# Altium schematic sheet MAIN.SchDoc
size Legal; Author: FF7 HD Remastered; SheetNumber: 1; SheetTotal: 7
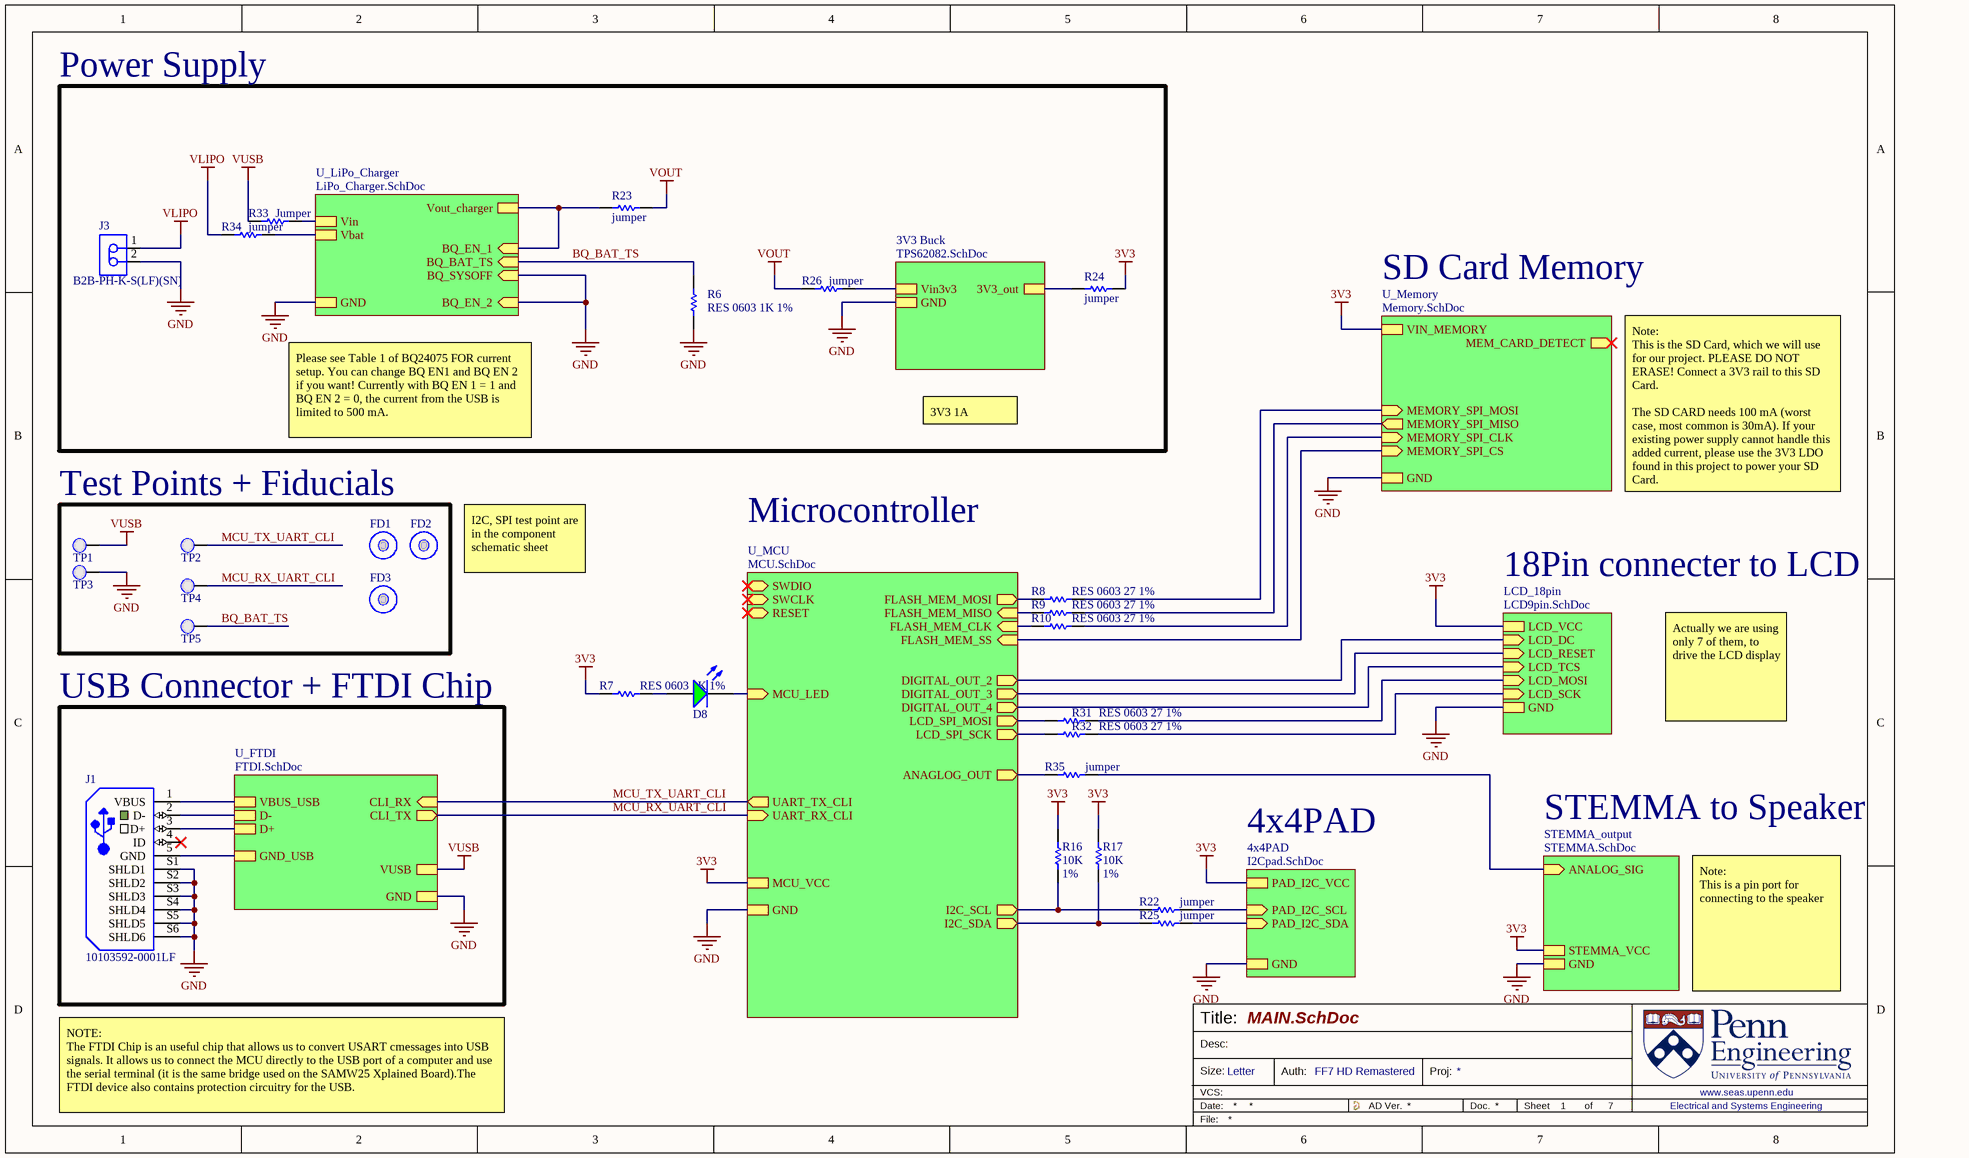
[diagram p0: MAIN.SchDoc]

## Parts
D8  LSM0805452V  [LED_0805]  (value not drawn)
FD1  Fiducial 40x100mm  [Fiducial 40x100mm-Footprint-1]  (value not drawn)
FD2  Fiducial 40x100mm  [Fiducial 40x100mm-Footprint-1]  (value not drawn)
FD3  Fiducial 40x100mm  [Fiducial 40x100mm-Footprint-1]  (value not drawn)
J1  10103592-0001LF  [10103592-0001LF-Footprint-1]
J3  B2B-PH-K-S(LF)(SN)  [JST-B2B-PH-K-S_V]
R6  RES 0603 1K 1%  [0603_RES]
R7  RES 0603 1K 1%  [0603_RES]
R8  RES 0603 27 1%  [0603_RES]
R9  RES 0603 27 1%  [0603_RES]
R10  RES 0603 27 1%  [0603_RES]
R16  value 10K  Tolerance: 1%  [0402_RES]  (hidden comment: RES 0402 10K 1%)
R17  value 10K  Tolerance: 1%  [0402_RES]  (hidden comment: RES 0402 10K 1%)
R22  jumper  [0805_RES]  (no BOM)
R23  jumper  [0805_RES]  (no BOM)
R24  jumper  [0805_RES]  (no BOM)
R25  jumper  [0805_RES]  (no BOM)
R26  jumper  [0805_RES]  (no BOM)
R31  RES 0603 27 1%  [0603_RES]
R32  RES 0603 27 1%  [0603_RES]
R33  Jumper  [0805_RES]  (no BOM)
R34  jumper  [0805_RES]  (no BOM)
R35  jumper  [0805_RES]  (no BOM)
TP1  Test Point 0.1"  [Test Point 0.1"-Footprint-1]  (value not drawn)  (no BOM)
TP2  Test Point 0.1"  [Test Point 0.1"-Footprint-1]  (value not drawn)  (no BOM)
TP3  Test Point 0.1"  [Test Point 0.1"-Footprint-1]  (value not drawn)  (no BOM)
TP4  Test Point 0.1"  [Test Point 0.1"-Footprint-1]  (value not drawn)  (no BOM)
TP5  Test Point 0.1"  [Test Point 0.1"-Footprint-1]  (value not drawn)  (no BOM)

## Blocks framed on the sheet
Power Supply: J3 R6 R23 R24 R26 R33 R34
Test Points + Fiducials: FD1-FD3 TP1-TP5
USB Connector + FTDI Chip: J1

## Sub-sheets
3V3 Buck = TPS62082.SchDoc: Vin3v3, GND, 3V3_out
4x4PAD = I2Cpad.SchDoc: PAD_I2C_SCL (in), PAD_I2C_SDA (in), PAD_I2C_VCC, GND
LCD_18pin = LCD9pin.SchDoc: LCD_VCC, LCD_SCK (in), LCD_MOSI (in), LCD_DC (in), LCD_RESET (in), LCD_TCS (in), GND
STEMMA_output = STEMMA.SchDoc: ANALOG_SIG (in), STEMMA_VCC, GND
U_FTDI = FTDI.SchDoc: CLI_RX (in), CLI_TX (out), VUSB, GND, VBUS_USB, D-, D+, GND_USB
U_LiPo_Charger = LiPo_Charger.SchDoc: BQ_EN_2 (in), BQ_SYSOFF (in), BQ_EN_1 (in), BQ_BAT_TS (in), Vin, GND, Vbat, Vout_charger
U_MCU = MCU.SchDoc: SWDIO (bidir), SWCLK (in), UART_TX_CLI (out), UART_RX_CLI (in), FLASH_MEM_SS (in), FLASH_MEM_CLK (in), FLASH_MEM_MISO (in), FLASH_MEM_MOSI (out), RESET (bidir), MCU_LED (in), MCU_VCC, GND, I2C_SCL (out), I2C_SDA (out), ANAGLOG_OUT (out), DIGITAL_OUT_2 (out), LCD_SPI_MOSI (out), LCD_SPI_SCK (out), DIGITAL_OUT_3 (out), DIGITAL_OUT_4 (out)
U_Memory = Memory.SchDoc: MEMORY_SPI_MOSI (in), MEMORY_SPI_MISO (out), MEMORY_SPI_CLK (in), MEMORY_SPI_CS (in), MEM_CARD_DETECT (out), VIN_MEMORY, GND

## Nets
3V3: R7.2 R16.2 R17.2 R24.2 ; sheet U_MCU/MCU_VCC, sheet U_Memory/VIN_MEMORY, sheet STEMMA_output/STEMMA_VCC, sheet LCD_18pin/LCD_VCC, sheet 4x4PAD/PAD_I2C_VCC
GND: J1.S1(SHLD1) J1.S2(SHLD2) J1.S3(SHLD3) J1.S4(SHLD4) J1.S5(SHLD5) J1.S6(SHLD6) J3.2 R6.1 TP3.1(PAD) ; sheet U_FTDI/GND, sheet U_MCU/GND, sheet U_Memory/GND, sheet U_LiPo_Charger/BQ_EN_2, sheet U_LiPo_Charger/BQ_SYSOFF, sheet U_LiPo_Charger/GND, sheet STEMMA_output/GND, sheet LCD_18pin/GND, sheet 3V3 Buck/GND, sheet 4x4PAD/GND
VLIPO: J3.1 R34.1
VOUT: R23.2 R26.1
VUSB: R33.1 TP1.1(PAD) ; sheet U_FTDI/VUSB
BQ_BAT_TS: R6.2 TP5.1(PAD) ; sheet U_LiPo_Charger/BQ_BAT_TS
MCU_RX_UART_CLI: TP4.1(PAD) ; sheet U_FTDI/CLI_TX, sheet U_MCU/UART_RX_CLI
MCU_TX_UART_CLI: TP2.1(PAD) ; sheet U_FTDI/CLI_RX, sheet U_MCU/UART_TX_CLI
NetD8_A: D8.A R7.1
NetD8_K: D8.K ; sheet U_MCU/MCU_LED
NetJ1_1: J1.1(VBUS) ; sheet U_FTDI/VBUS_USB
NetJ1_2: J1.2(D-) ; sheet U_FTDI/D-
NetJ1_3: J1.3(D+) ; sheet U_FTDI/D+
NetJ1_5: J1.5(GND) ; sheet U_FTDI/GND_USB
NetR8_1: R8.1 ; sheet U_MCU/FLASH_MEM_MOSI
NetR8_2: R8.2 ; sheet U_Memory/MEMORY_SPI_MOSI
NetR9_1: R9.1 ; sheet U_MCU/FLASH_MEM_MISO
NetR9_2: R9.2 ; sheet U_Memory/MEMORY_SPI_MISO
NetR10_1: R10.1 ; sheet U_MCU/FLASH_MEM_CLK
NetR10_2: R10.2 ; sheet U_Memory/MEMORY_SPI_CLK
NetR16_1: R16.1 R22.1 ; sheet U_MCU/I2C_SCL
NetR17_1: R17.1 R25.1 ; sheet U_MCU/I2C_SDA
NetR22_2: R22.2 ; sheet 4x4PAD/PAD_I2C_SCL
NetR23_1: R23.1 ; sheet U_LiPo_Charger/BQ_EN_1, sheet U_LiPo_Charger/Vout_charger
NetR24_1: R24.1 ; sheet 3V3 Buck/3V3_out
NetR25_2: R25.2 ; sheet 4x4PAD/PAD_I2C_SDA
NetR26_2: R26.2 ; sheet 3V3 Buck/Vin3v3
NetR31_1: R31.1 ; sheet U_MCU/LCD_SPI_MOSI
NetR31_2: R31.2 ; sheet LCD_18pin/LCD_MOSI
NetR32_1: R32.1 ; sheet U_MCU/LCD_SPI_SCK
NetR32_2: R32.2 ; sheet LCD_18pin/LCD_SCK
NetR33_2: R33.2 ; sheet U_LiPo_Charger/Vin
NetR34_2: R34.2 ; sheet U_LiPo_Charger/Vbat
NetR35_1: R35.1 ; sheet U_MCU/ANAGLOG_OUT
NetR35_2: R35.2 ; sheet STEMMA_output/ANALOG_SIG
(unnamed): sheet U_MCU/FLASH_MEM_SS, sheet U_Memory/MEMORY_SPI_CS
(unnamed): sheet U_MCU/DIGITAL_OUT_2, sheet LCD_18pin/LCD_DC
(unnamed): sheet U_MCU/DIGITAL_OUT_3, sheet LCD_18pin/LCD_RESET
(unnamed): sheet U_MCU/DIGITAL_OUT_4, sheet LCD_18pin/LCD_TCS

Not connected (* = marked no-connect by the designer): J1 4(ID)*

## Notes on the sheet
- SD Card Memory
- Please see Table 1 of BQ24075 FOR current setup. You can change BQ EN1 and BQ EN 2 if you want! Currently with BQ EN 1 = 1 and BQ EN 2 = 0, the current from the USB is limited to 500 mA.
- 3V3 1A
- Note:
  This is the SD Card, which we will use for our project. PLEASE DO NOT ERASE! Connect a 3V3 rail to this SD Card.
  The SD CARD needs 100 mA (worst case, most common is 30mA). If your existing power supply cannot handle this added current, please use the 3V3 LDO found in this project to power your SD Card.
- (near FD2) I2C, SPI test point are in the component schematic sheet
- Microcontroller
- 18Pin connecter to LCD
- Actually we are using only 7 of them, to drive the LCD display
- 4x4PAD
- STEMMA to Speaker
- Note:
  This is a pin port for connecting to the speaker
- NOTE:
  The FTDI Chip is an useful chip that allows us to convert USART cmessages into USB signals. It allows us to connect the MCU directly to the USB port of a computer and use the serial terminal (it is the same bridge used on the SAMW25 Xplained Board).The FTDI device also contains protection circuitry for the USB.
- Title:
- Desc:
- Size:
- Letter
- Auth:
- Proj:
- Sheet
- of
- www.seas.upenn.edu
- Electrical and Systems Engineering

## Library data of the parts
D8 = CMP-00038-3: Single Color LED, Green, 0805; Test Current: 20mA; Forward Voltage: 2V; RoHS Compliant: Yes
FD1-FD3 = CMP-00085-1
J1 = CMP-00092-5: Conn Micro USB 2.0 Type B RCP 5 POS 0.65mm Solder RA SMD 5 Terminal 1 Port T/R
J3 = CMP-2000-05162-1: Male Header, Pitch 2 mm, 1 x 2 Position, Height 6 mm, Tail Length 3.4 mm, -25 to 85 degC, RoHS, Bulk; Manufacturer: JST; Pitch: 2mm; Style/Orientation: StraightHeader/Plug; No of Positions: 2; Datasheet Version: Nov-08; Datasheet URL: http://datasheet.octopart.com/B2B-PH-K-S%28LF%29%28SN%29-JST-datasheet-8324864.pdf; Manufacturer URL: http://www.jst.com/home2.html; Type: ShroudedHeader; Termination: Crimp
R6 R7 = CMP-005-002503-2: Resistor Surface Mount, 1K Ohms, 0603 Footprint, 1% Tolerance 0.1W; Manufacturer: Various; PCB Package: 0603; Description in Visual: Res SMT 1K 0603  1%  0.1W; Tolerance: 1%; Value: 1k; Mount: SMT; Power Rating: 0.1W; Manufacturer P/N: RES 0603 1K 1%; JLCPCB Part #: C21190
R8-R10 R31 R32 = CMP-005-002764-1: Resistor Surface Mount, 27 Ohms, 0603 Footprint, 1% Tolerance 0.1W; Manufacturer P/N: RES 0603 27R 1%; Manufacturer: Various; Description in Visual: Res SMT 27 0603  1%  0.1W; Value: 27; PCB Package: 0603; Mount: SMT; Tolerance: 1%; Power Rating: 0.1W
R16 R17 = CMP-005-000226-3: Resistor Surface Mount, 10K Ohms, 0402 Footprint, 1% Tolerance 0.063W; Manufacturer: Various; PCB Package: 0402; Description in Visual: Res SMT 10K 0402  1%  0.063W; Manufacturer P/N: RES 0402 10K 1%; Power Rating: 0.063W; Mount: SMT
R22-R25 R33 R35 = CMP-005-003861-1: Resistor Surface Mount, 0 Ohms, 0805 Footprint, 5% Tolerance 0.125W; Manufacturer P/N: RES 0805 0R 5%; Manufacturer: Various; Description in Visual: Res SMT 0 0805  5%  0.125W; PCB Package: 0805; Value: 0; Mount: SMT; Power Rating: 0.125W; Tolerance: 5%
R26 R34 = CMP-005-003861-1: Resistor Surface Mount, 0 Ohms, 0805 Footprint, 5% Tolerance 0.125W; Manufacturer P/N: RES 0805 0R 5%; Manufacturer: Various; Description in Visual: Res SMT 0 0805  5%  0.125W; PCB Package: 0805; Mount: SMT; Power Rating: 0.125W
TP1-TP5 = CMP-00086-1